# EAGLE schematic helix_4_minimal_template (EAGLE 6.5.0)
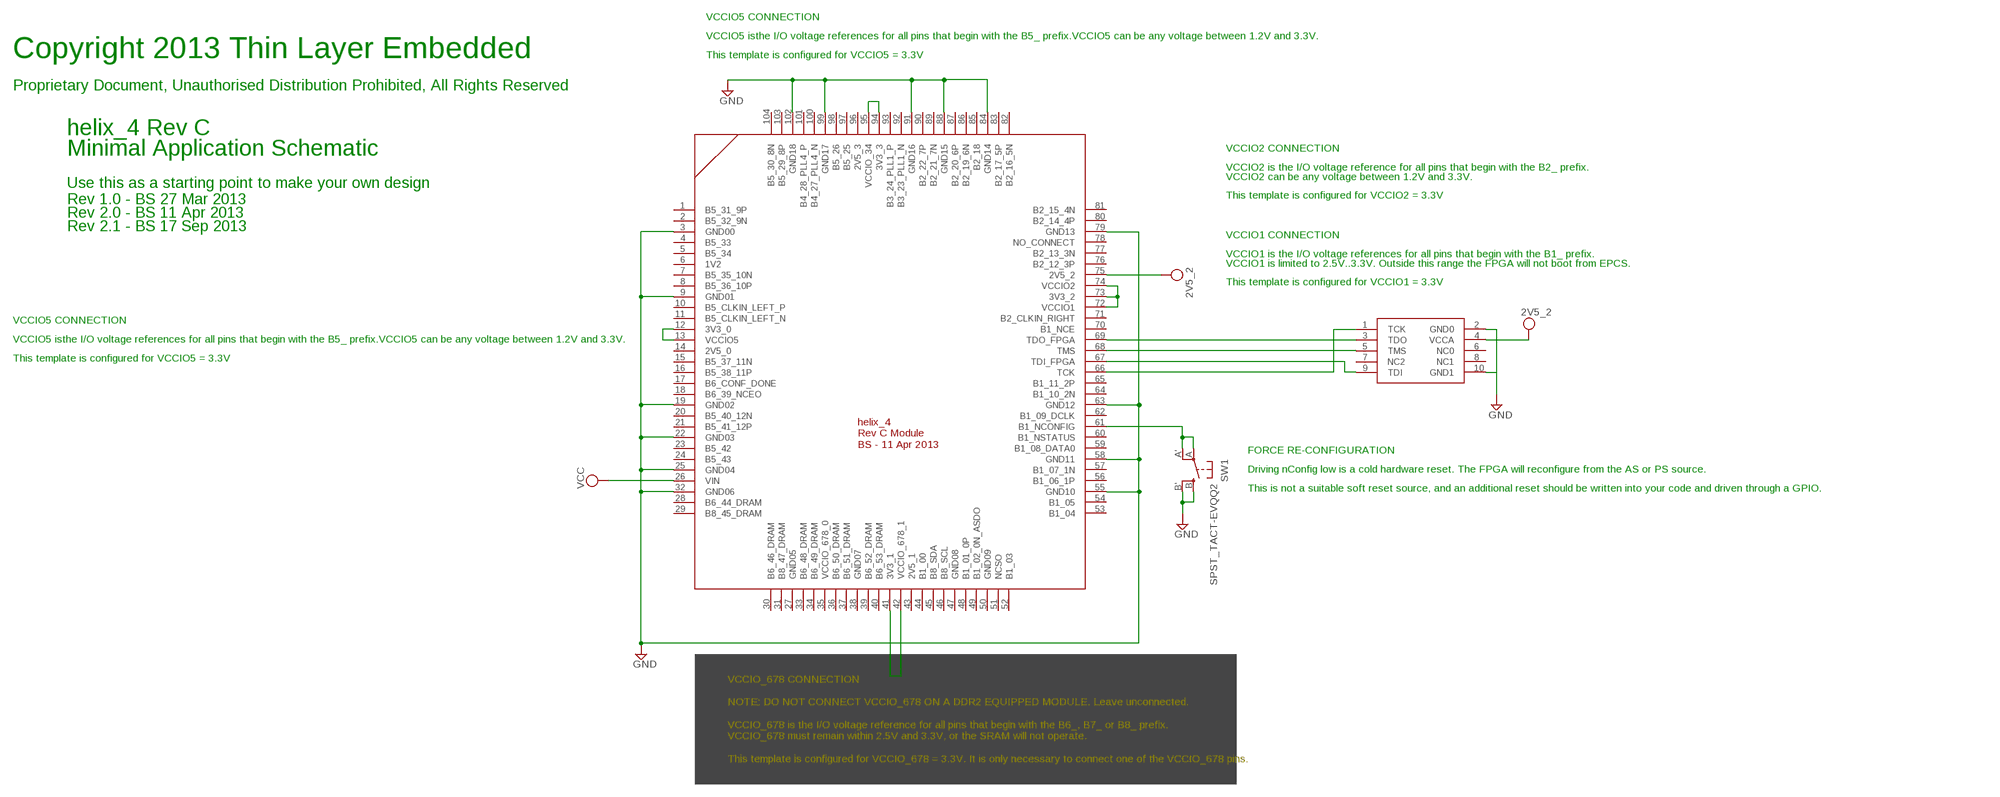
[diagram p0: schematic, sheet 1]

## Parts
SW1  SPST_TACT-EVQQ2  [EVQ-Q2]
U$1  HELIX_4_REV_C  [HELIX_4_REVB_LCC104]
U$3  JTAG_HDR  [HDR_2X10_SMD]

## Nets
GND: U$1.3(GND00) U$1.9(GND01) U$1.19(GND02) U$1.22(GND03) U$1.25(GND04) U$1.32(GND06) U$1.55(GND10) U$1.58(GND11) U$1.63(GND12) U$1.79(GND13) U$1.84(GND14) U$1.88(GND15) U$1.91(GND16) U$1.99(GND17) U$1.102(GND18) U$3.2(GND0) U$3.10(GND1)
N$1: U$1.68(TMS) U$3.5(TMS)
N$2: U$1.69(TDO_FPGA) U$3.3(TDO)
N$3: U$1.67(TDI_FPGA) U$3.9(TDI)
N$4: U$1.66(TCK) U$3.1(TCK)
N$5: U$1.94(3V3_3) U$1.95(VCCIO_34)
N$7: U$1.12(3V3_0) U$1.13(VCCIO5)
N$10: SW1.B'(S1) SW1.B(S) ; supply symbol labelled GND
N$11: SW1.A'(P1) SW1.A(P) U$1.61(B1_NCONFIG)
N$12: U$1.72(VCCIO1) U$1.73(3V3_2) U$1.74(VCCIO2)
VCC: U$1.26(VIN) U$1.75(2V5_2) U$3.4(VCCA) ; supply symbol labelled 2V5_2
VCCIO_678: U$1.41(3V3_1) U$1.42(VCCIO_678_1)
Unconnected: U$1.1(B5_31_9P) U$1.2(B5_32_9N) U$1.4(B5_33) U$1.5(B5_34) U$1.6(1V2) U$1.7(B5_35_10N) U$1.8(B5_36_10P) U$1.10(B5_CLKIN_LEFT_P) U$1.11(B5_CLKIN_LEFT_N) U$1.14(2V5_0) U$1.15(B5_37_11N) U$1.16(B5_38_11P) U$1.17(B6_CONF_DONE) U$1.18(B6_39_NCEO) U$1.20(B5_40_12N) U$1.21(B5_41_12P) U$1.23(B5_42) U$1.24(B5_43) U$1.27(GND05) U$1.28(B6_44_DRAM) U$1.29(B8_45_DRAM) U$1.30(B6_46_DRAM) U$1.31(B8_47_DRAM) U$1.33(B6_48_DRAM) U$1.34(B6_49_DRAM) U$1.35(VCCIO_678_0) U$1.36(B6_50_DRAM) U$1.37(B6_51_DRAM) U$1.38(GND07) U$1.39(B6_52_DRAM) U$1.40(B6_53_DRAM) U$1.43(2V5_1) U$1.44(B1_00) U$1.45(B8_SDA) U$1.46(B8_SCL) U$1.47(GND08) U$1.48(B1_01_0P) U$1.49(B1_02_0N_ASDO) U$1.50(GND09) U$1.51(NCSO) U$1.52(B1_03) U$1.53(B1_04) U$1.54(B1_05) U$1.56(B1_06_1P) U$1.57(B1_07_1N) U$1.59(B1_08_DATA0) U$1.60(B1_NSTATUS) U$1.62(B1_09_DCLK) U$1.64(B1_10_2N) U$1.65(B1_11_2P) U$1.70(B1_NCE) U$1.71(B2_CLKIN_RIGHT) U$1.76(B2_12_3P) U$1.77(B2_13_3N) U$1.78(NO_CONNECT) U$1.80(B2_14_4P) U$1.81(B2_15_4N) U$1.82(B2_16_5N) U$1.83(B2_17_5P) U$1.85(B2_18) U$1.86(B2_19_6N) U$1.87(B2_20_6P) U$1.89(B2_21_7N) U$1.90(B2_22_7P) U$1.92(B3_23_PLL1_N) U$1.93(B3_24_PLL1_P) U$1.96(2V5_3) U$1.97(B5_25) U$1.98(B5_26) U$1.100(B4_27_PLL4_N) U$1.101(B4_28_PLL4_P) U$1.103(B5_29_8P) U$1.104(B5_30_8N) U$3.6(NC0) U$3.7(NC2) U$3.8(NC1)

## Notes on the sheet
- Copyright 2013 Thin Layer Embedded
- VCCIO5 CONNECTION
  
  VCCIO5 isthe I/O voltage references for all pins that begin with the B5_ prefix.VCCIO5 can be any voltage between 1.2V and 3.3V.
  
  This template is configured for VCCIO5 = 3.3V
- Proprietary Document, Unauthorised Distribution Prohibited, All Rights Reserved
- helix_4 Rev C
  Minimal Application Schematic
- Use this as a starting point to make your own design
- VCCIO2 CONNECTION
  
  VCCIO2 is the I/O voltage reference for all pins that begin with the B2_ prefix.
  VCCIO2 can be any voltage between 1.2V and 3.3V.
  
  This template is configured for VCCIO2 = 3.3V
- Rev 1.0 - BS 27 Mar 2013
  Rev 2.0 - BS 11 Apr 2013
  Rev 2.1 - BS 17 Sep 2013
- VCCIO1 CONNECTION
  
  VCCIO1 is the I/O voltage references for all pins that begin with the B1_ prefix.
  VCCIO1 is limited to 2.5V..3.3V. Outside this range the FPGA will not boot from EPCS. 
  
  This template is configured for VCCIO1 = 3.3V
- VCCIO5 CONNECTION
  
  VCCIO5 isthe I/O voltage references for all pins that begin with the B5_ prefix.VCCIO5 can be any voltage between 1.2V and 3.3V.
  
  This template is configured for VCCIO5 = 3.3V
- FORCE RE-CONFIGURATION
  
  Driving nConfig low is a cold hardware reset. The FPGA will reconfigure from the AS or PS source.
  
  This is not a suitable soft reset source, and an additional reset should be written into your code and driven through a GPIO.
- VCCIO_678 CONNECTION
  
  NOTE: DO NOT CONNECT VCCIO_678 ON A DDR2 EQUIPPED MODULE. Leave unconnected.
  
  VCCIO_678 is the I/O voltage reference for all pins that begin with the B6_, B7_ or B8_ prefix.
  VCCIO_678 must remain within 2.5V and 3.3V, or the SRAM will not operate.
  
  This template is configured for VCCIO_678 = 3.3V. It is only necessary to connect one of the VCCIO_678 pins.

## Library data of the parts
SW1 = adafruit:SPST_TACT: SMT 6mm switch, EVQQ2 series http://www.ladyada.net/library/eagle
U$1 = thin_layer:HELIX_4_REV_C
U$3 = thin_layer:JTAG_HDR